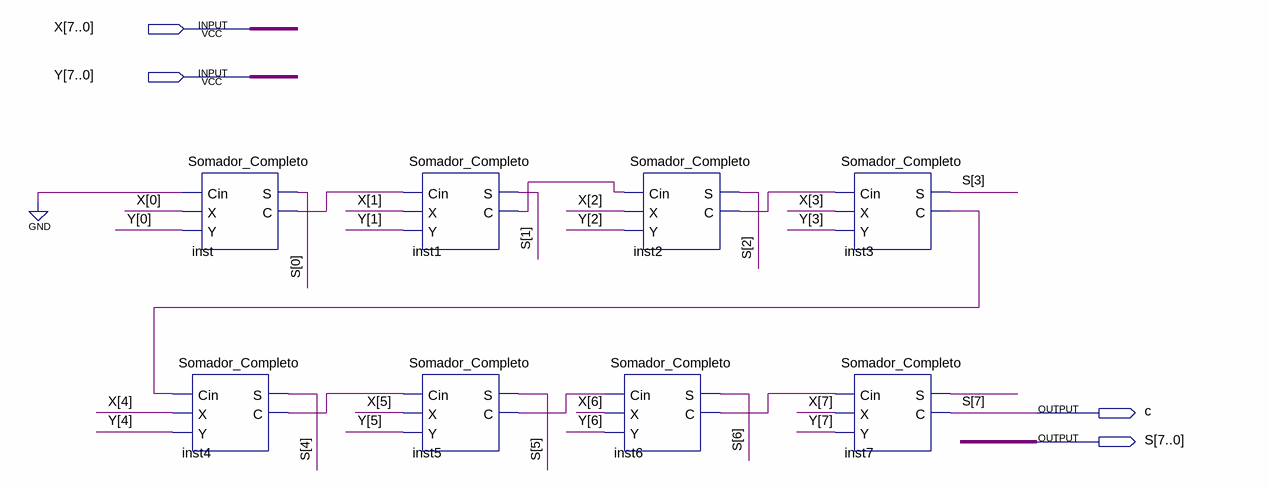
[diagram p0: schematic sheet]
// Quartus schematic Somador_8_bits.bdf as structural Verilog: 8 symbols, 4 pins
module Somador_8_bits (
  input  [7:0] X,
  input  [7:0] Y,
  output c,
  output [7:0] S
);

  wire inst1_c, inst2_c, inst3_c, inst4_c, inst5_c, inst6_c, inst7_s, inst_c;

  Somador_Completo inst (.Cin(1'b0), .X(X[0]), .Y(Y[0]), .S(S[0]), .C(inst_c));
  Somador_Completo inst4 (.Cin(inst3_c), .X(X[4]), .Y(Y[4]), .S(S[4]), .C(inst4_c));
  Somador_Completo inst1 (.Cin(inst_c), .X(X[1]), .Y(Y[1]), .S(S[1]), .C(inst1_c));
  Somador_Completo inst5 (.Cin(inst4_c), .X(X[5]), .Y(Y[5]), .S(S[5]), .C(inst5_c));
  Somador_Completo inst2 (.Cin(inst1_c), .X(X[2]), .Y(Y[2]), .S(S[2]), .C(inst2_c));
  Somador_Completo inst6 (.Cin(inst5_c), .X(X[6]), .Y(Y[6]), .S(S[6]), .C(inst6_c));
  Somador_Completo inst3 (.Cin(inst2_c), .X(X[3]), .Y(Y[3]), .S(S[3]), .C(inst3_c));
  Somador_Completo inst7 (.Cin(inst6_c), .X(X[7]), .Y(Y[7]), .S(inst7_s), .C(c));

  assign S[7] = c;
endmodule
